# Altium schematic sheet tempature.schdoc: TEMP
size A4; Date: 10.25.2025; CheckedBy: BCY; DrawnBy: miaow; DocumentNumber: 8; Revision: v1.0.0; SheetNumber: 8; SheetTotal: 14; BoardType: MAIN_PCB; Desc: NTC tempature sensor
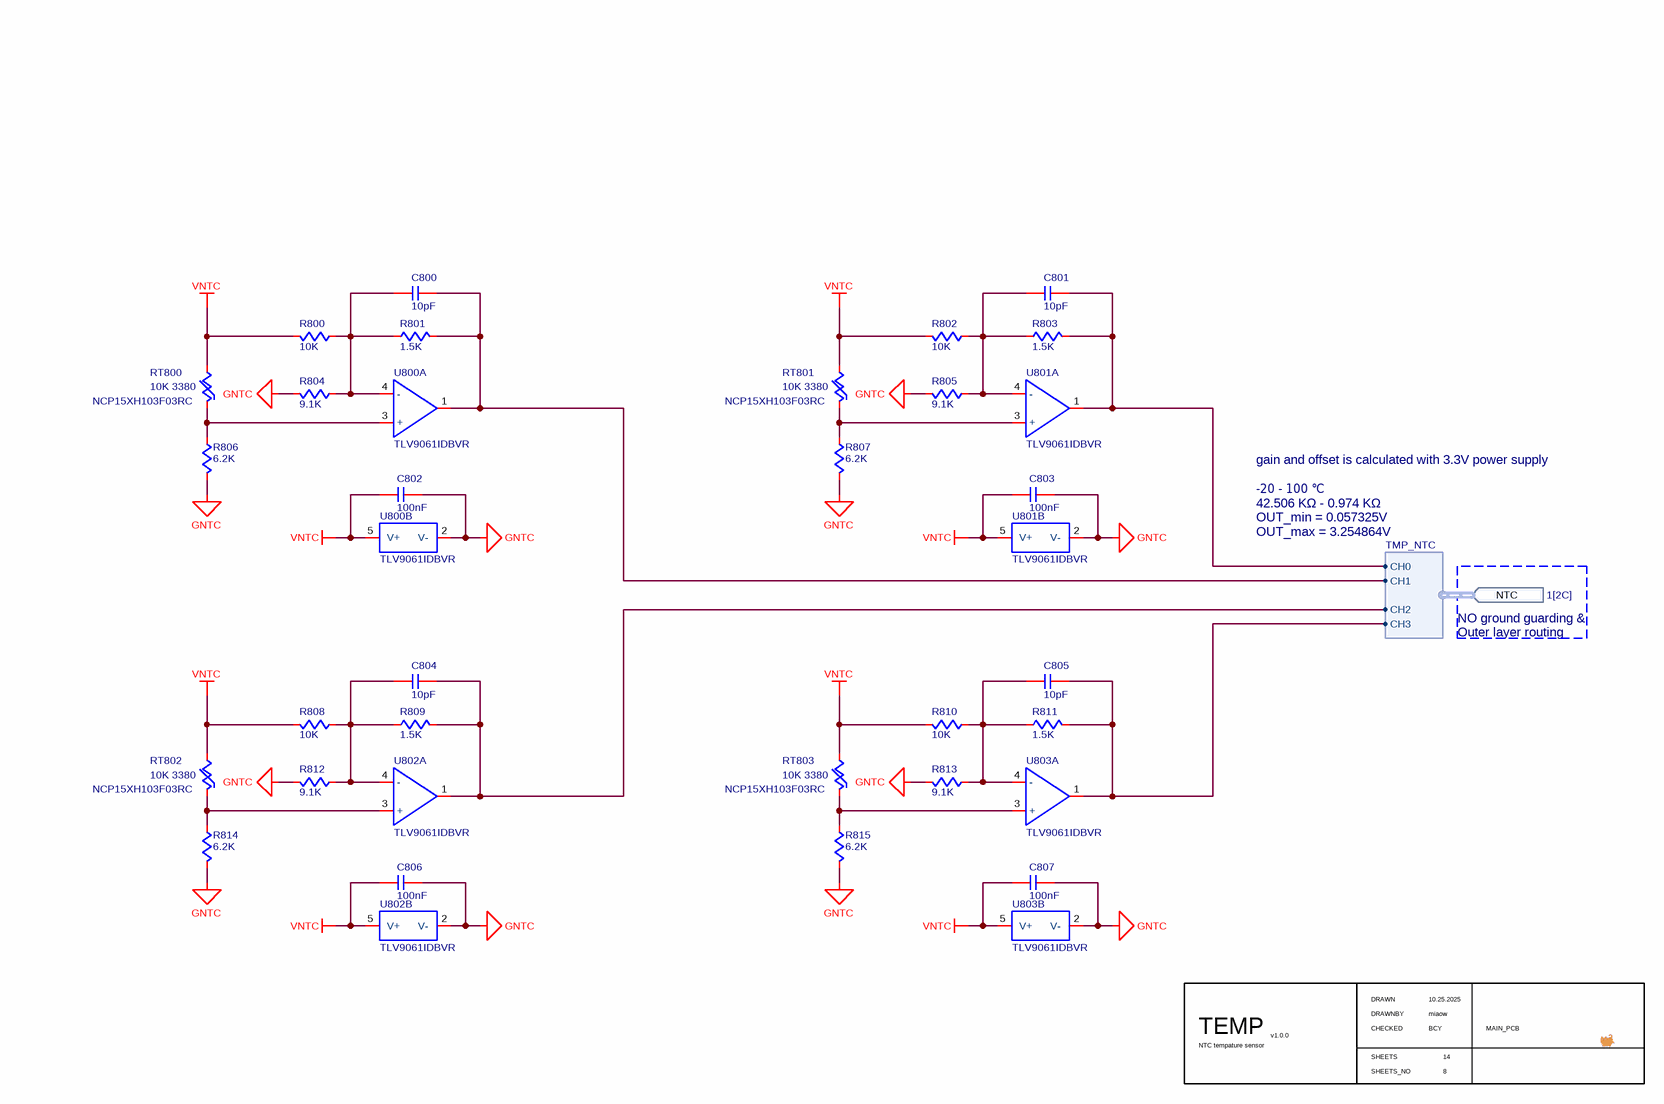
[diagram p0: tempature.schdoc]

## Parts
C800  value 10pF  [C0402]  (hidden comment: C-NOMO)
C801  value 10pF  [C0402]  (hidden comment: C-NOMO)
C802  value 100nF  [C0402]  (hidden comment: C-NOMO)
C803  value 100nF  [C0402]  (hidden comment: C-NOMO)
C804  value 10pF  [C0402]  (hidden comment: C-NOMO)
C805  value 10pF  [C0402]  (hidden comment: C-NOMO)
C806  value 100nF  [C0402]  (hidden comment: C-NOMO)
C807  value 100nF  [C0402]  (hidden comment: C-NOMO)
R800  value 10K  [R0402]  (hidden comment: R)
R801  value 1.5K  [R0402]  (hidden comment: R)
R802  value 10K  [R0402]  (hidden comment: R)
R803  value 1.5K  [R0402]  (hidden comment: R)
R804  value 9.1K  [R0402]  (hidden comment: R)
R805  value 9.1K  [R0402]  (hidden comment: R)
R806  value 6.2K  [R0402]  (hidden comment: R)
R807  value 6.2K  [R0402]  (hidden comment: R)
R808  value 10K  [R0402]  (hidden comment: R)
R809  value 1.5K  [R0402]  (hidden comment: R)
R810  value 10K  [R0402]  (hidden comment: R)
R811  value 1.5K  [R0402]  (hidden comment: R)
R812  value 9.1K  [R0402]  (hidden comment: R)
R813  value 9.1K  [R0402]  (hidden comment: R)
R814  value 6.2K  [R0402]  (hidden comment: R)
R815  value 6.2K  [R0402]  (hidden comment: R)
RT800  NCP15XH103F03RC  value 10K 3380  [NTC0402]
RT801  NCP15XH103F03RC  value 10K 3380  [NTC0402]
RT802  NCP15XH103F03RC  value 10K 3380  [NTC0402]
RT803  NCP15XH103F03RC  value 10K 3380  [NTC0402]
U800  TLV9061IDBVR  [TLV9061IDBVR]  (parts A,B of 2)
U801  TLV9061IDBVR  [TLV9061IDBVR]  (parts A,B of 2)
U802  TLV9061IDBVR  [TLV9061IDBVR]  (parts A,B of 2)
U803  TLV9061IDBVR  [TLV9061IDBVR]  (parts A,B of 2)

## Ports
NTC (in, harness TMP_NTC, see 1[2C])

## Harnesses
TMP_NTC: CH0, CH1, CH2, CH3

## Nets
GNTC: C802.1 C803.1 C806.1 C807.1 R804.1 R805.1 R806.1 R807.1 R812.1 R813.1 R814.1 R815.1 U800.2(V-) U801.2(V-) U802.2(V-) U803.2(V-)
VNTC: C802.2 C803.2 C806.2 C807.2 R800.1 R802.1 R808.1 R810.1 RT800.2 RT801.2 RT802.2 RT803.2 U800.5(V+) U801.5(V+) U802.5(V+) U803.5(V+)
NetC800_1: C800.1 R801.1 U800.1(OUT) ; port NTC.CH1
NetC800_2: C800.2 R800.2 R801.2 R804.2 U800.4(-)
NetC801_1: C801.1 R803.1 U801.1(OUT) ; port NTC.CH0
NetC801_2: C801.2 R802.2 R803.2 R805.2 U801.4(-)
NetC804_1: C804.1 R809.1 U802.1(OUT) ; port NTC.CH2
NetC804_2: C804.2 R808.2 R809.2 R812.2 U802.4(-)
NetC805_1: C805.1 R811.1 U803.1(OUT) ; port NTC.CH3
NetC805_2: C805.2 R810.2 R811.2 R813.2 U803.4(-)
NetR806_2: R806.2 RT800.1 U800.3(+)
NetR807_2: R807.2 RT801.1 U801.3(+)
NetR814_2: R814.2 RT802.1 U802.3(+)
NetR815_2: R815.2 RT803.1 U803.3(+)

## Notes on the sheet
- gain and offset is calculated with 3.3V power supply
- -20 - 100 ℃
  42.506 KΩ - 0.974 KΩ
  OUT_min = 0.057325V
  OUT_max = 3.254864V
- NO ground guarding &
  Outer layer routing
- DRAWN
- CHECKED
- DRAWNBY
- SHEETS
- SHEETS_NO

## Library data of the parts
C800-C807 = C-NOMO: voltage: 25V; precision: 5%
R800-R815 = R: precision: 1%
RT800-RT803 = NCP15XH103F03RC: NTC - 10K, 3380, 1%; precision: 1%; Supplier Part Number 1: C13564; Supplier 1: LCSC
U800-U803 = TLV9061IDBVR: OPA - 1ch, 1.8V - 5.5V, r2r, 0.3mV, 10MHz, 10nVHz^0.5, 0.5pA; Supplier 1: LCSC; Supplier Part Number 1: C398358